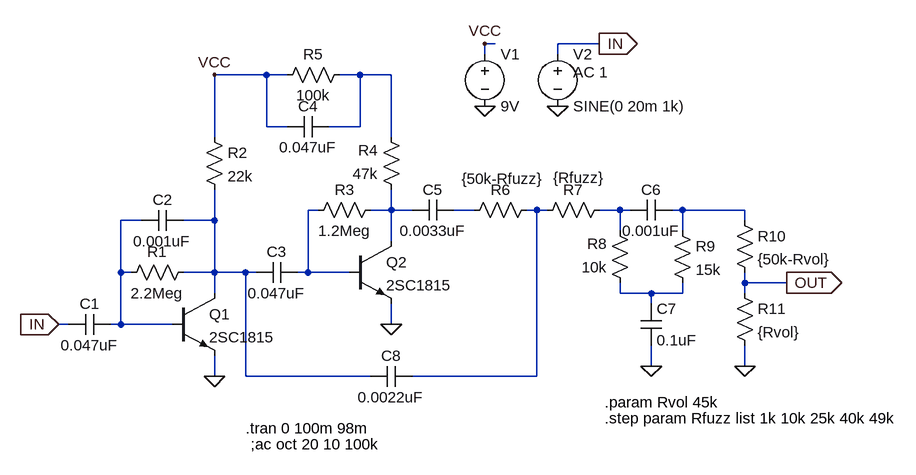
[diagram p0: schematic FY-2.asc]
FY-2.asc, the LTspice schematic file:
Version 4
SHEET 1 1400 680
WIRE 704 -288 688 -288
WIRE 864 -288 800 -288
WIRE 688 -272 688 -288
WIRE 800 -272 800 -288
WIRE 352 -240 272 -240
WIRE 384 -240 352 -240
WIRE 496 -240 464 -240
WIRE 544 -240 496 -240
WIRE 352 -160 352 -240
WIRE 384 -160 352 -160
WIRE 496 -160 496 -240
WIRE 496 -160 448 -160
WIRE 272 -144 272 -240
WIRE 544 -144 544 -240
WIRE 432 -32 416 -32
WIRE 544 -32 544 -64
WIRE 544 -32 512 -32
WIRE 576 -32 544 -32
WIRE 672 -32 640 -32
WIRE 768 -32 752 -32
WIRE 784 -32 768 -32
WIRE 896 -32 864 -32
WIRE 912 -32 896 -32
WIRE 992 -32 976 -32
WIRE 1088 -32 992 -32
WIRE 160 -16 128 -16
WIRE 272 -16 272 -64
WIRE 272 -16 224 -16
WIRE 1088 -16 1088 -32
WIRE 896 0 896 -32
WIRE 992 0 992 -32
WIRE 544 16 544 -32
WIRE 128 64 128 -16
WIRE 144 64 128 64
WIRE 272 64 272 -16
WIRE 272 64 224 64
WIRE 320 64 272 64
WIRE 336 64 320 64
WIRE 416 64 416 -32
WIRE 416 64 400 64
WIRE 480 64 416 64
WIRE 1088 80 1088 64
WIRE 1152 80 1088 80
WIRE 272 96 272 64
WIRE 896 96 896 80
WIRE 944 96 896 96
WIRE 992 96 992 80
WIRE 992 96 944 96
WIRE 1088 96 1088 80
WIRE 944 112 944 96
WIRE 48 144 32 144
WIRE 128 144 128 64
WIRE 128 144 112 144
WIRE 208 144 128 144
WIRE 544 144 544 112
WIRE 944 208 944 176
WIRE 1088 208 1088 176
WIRE 272 224 272 192
WIRE 320 224 320 64
WIRE 512 224 320 224
WIRE 768 224 768 -32
WIRE 768 224 576 224
FLAG 272 224 0
FLAG 544 144 0
FLAG 944 208 0
FLAG 1088 208 0
FLAG 1152 80 OUT
IOPIN 1152 80 Out
FLAG 32 144 IN
IOPIN 32 144 In
FLAG 688 -192 0
FLAG 800 -192 0
FLAG 864 -288 IN
IOPIN 864 -288 Out
FLAG 688 -288 VCC
FLAG 272 -240 VCC
SYMBOL cap 112 128 R90
WINDOW 0 0 32 VBottom 2
WINDOW 3 32 32 VTop 2
SYMATTR InstName C1
SYMATTR Value 0.047uF
SYMBOL res 240 48 R90
WINDOW 0 0 56 VBottom 2
WINDOW 3 32 56 VTop 2
SYMATTR InstName R1
SYMATTR Value 2.2Meg
SYMBOL cap 224 -32 R90
WINDOW 0 0 32 VBottom 2
WINDOW 3 32 32 VTop 2
SYMATTR InstName C2
SYMATTR Value 0.001uF
SYMBOL res 256 -160 R0
SYMATTR InstName R2
SYMATTR Value 22k
SYMBOL npn 208 96 R0
SYMATTR InstName Q1
SYMATTR Value 2SC1815
SYMBOL cap 400 48 R90
WINDOW 0 0 32 VBottom 2
WINDOW 3 32 32 VTop 2
SYMATTR InstName C3
SYMATTR Value 0.047uF
SYMBOL npn 480 16 R0
SYMATTR InstName Q2
SYMATTR Value 2SC1815
SYMBOL res 528 -48 R90
WINDOW 0 0 56 VBottom 2
WINDOW 3 32 56 VTop 2
SYMATTR InstName R3
SYMATTR Value 1.2Meg
SYMBOL res 560 -48 R180
WINDOW 0 36 76 Left 2
WINDOW 3 36 40 Left 2
SYMATTR InstName R4
SYMATTR Value 47k
SYMBOL cap 448 -176 R90
WINDOW 0 0 32 VBottom 2
WINDOW 3 32 32 VTop 2
SYMATTR InstName C4
SYMATTR Value 0.047uF
SYMBOL res 480 -256 R90
WINDOW 0 0 56 VBottom 2
WINDOW 3 32 56 VTop 2
SYMATTR InstName R5
SYMATTR Value 100k
SYMBOL cap 640 -48 R90
WINDOW 0 0 32 VBottom 2
WINDOW 3 32 32 VTop 2
SYMATTR InstName C5
SYMATTR Value 0.0033uF
SYMBOL res 768 -48 R90
WINDOW 0 0 56 VBottom 2
WINDOW 3 -48 53 VTop 2
SYMATTR InstName R6
SYMATTR Value {50k-Rfuzz}
SYMBOL res 880 -48 R90
WINDOW 0 0 56 VBottom 2
WINDOW 3 -49 48 VTop 2
SYMATTR InstName R7
SYMATTR Value {Rfuzz}
SYMBOL res 912 96 R180
WINDOW 0 36 76 Left 2
WINDOW 3 36 40 Left 2
SYMATTR InstName R8
SYMATTR Value 10k
SYMBOL cap 976 -48 R90
WINDOW 0 0 32 VBottom 2
WINDOW 3 32 32 VTop 2
SYMATTR InstName C6
SYMATTR Value 0.001uF
SYMBOL res 976 -16 R0
SYMATTR InstName R9
SYMATTR Value 15k
SYMBOL cap 928 112 R0
SYMATTR InstName C7
SYMATTR Value 0.1uF
SYMBOL res 1072 -32 R0
SYMATTR InstName R10
SYMATTR Value {50k-Rvol}
SYMBOL res 1072 80 R0
SYMATTR InstName R11
SYMATTR Value {Rvol}
SYMBOL cap 576 208 R90
WINDOW 0 0 32 VBottom 2
WINDOW 3 32 32 VTop 2
SYMATTR InstName C8
SYMATTR Value 0.0022uF
SYMBOL voltage 688 -288 R0
WINDOW 123 0 0 Left 2
WINDOW 39 0 0 Left 2
SYMATTR InstName V1
SYMATTR Value 9V
SYMBOL voltage 800 -288 R0
WINDOW 123 24 44 Left 2
WINDOW 39 0 0 Left 2
SYMATTR Value2 AC 1
SYMATTR InstName V2
SYMATTR Value SINE(0 20m 1k)
TEXT 872 264 Left 2 !.param Rvol 45k
TEXT 872 288 Left 2 !.step param Rfuzz list 1k 10k 25k 40k 49k
TEXT 320 304 Left 2 !.tran 0 100m 98m
TEXT 328 328 Left 2 !;ac oct 20 10 100k

The netlist it stands for:
* FY-2.asc
C1 N008 IN 0.047uF
R1 N009 N008 2.2Meg
C2 N009 N008 0.001uF
R2 VCC N009 22k
Q1 N009 N008 0 0 2SC1815
C3 N002 N009 0.047uF
Q2 N003 N002 0 0 2SC1815
R3 N003 N002 1.2Meg
R4 N003 N001 47k
C4 N001 VCC 0.047uF
R5 N001 VCC 100k
C5 N004 N003 0.0033uF
R6 N005 N004 {50k-Rfuzz}
R7 N006 N005 {Rfuzz}
R8 N010 N006 10k
C6 N007 N006 0.001uF
R9 N007 N010 15k
C7 N010 0 0.1uF
R10 N007 OUT {50k-Rvol}
R11 OUT 0 {Rvol}
C8 N005 N009 0.0022uF
V1 VCC 0 9V
V2 IN 0 SINE(0 20m 1k) AC 1
.model NPN NPN
.model PNP PNP
.lib standard.bjt
.param Rvol 45k
.step param Rfuzz list 1k 10k 25k 40k 49k
.tran 0 100m 98m
;ac oct 20 10 100k
.backanno
.end